# EAGLE design Physics_module_mount_v1.1 (EAGLE 7.2.0)
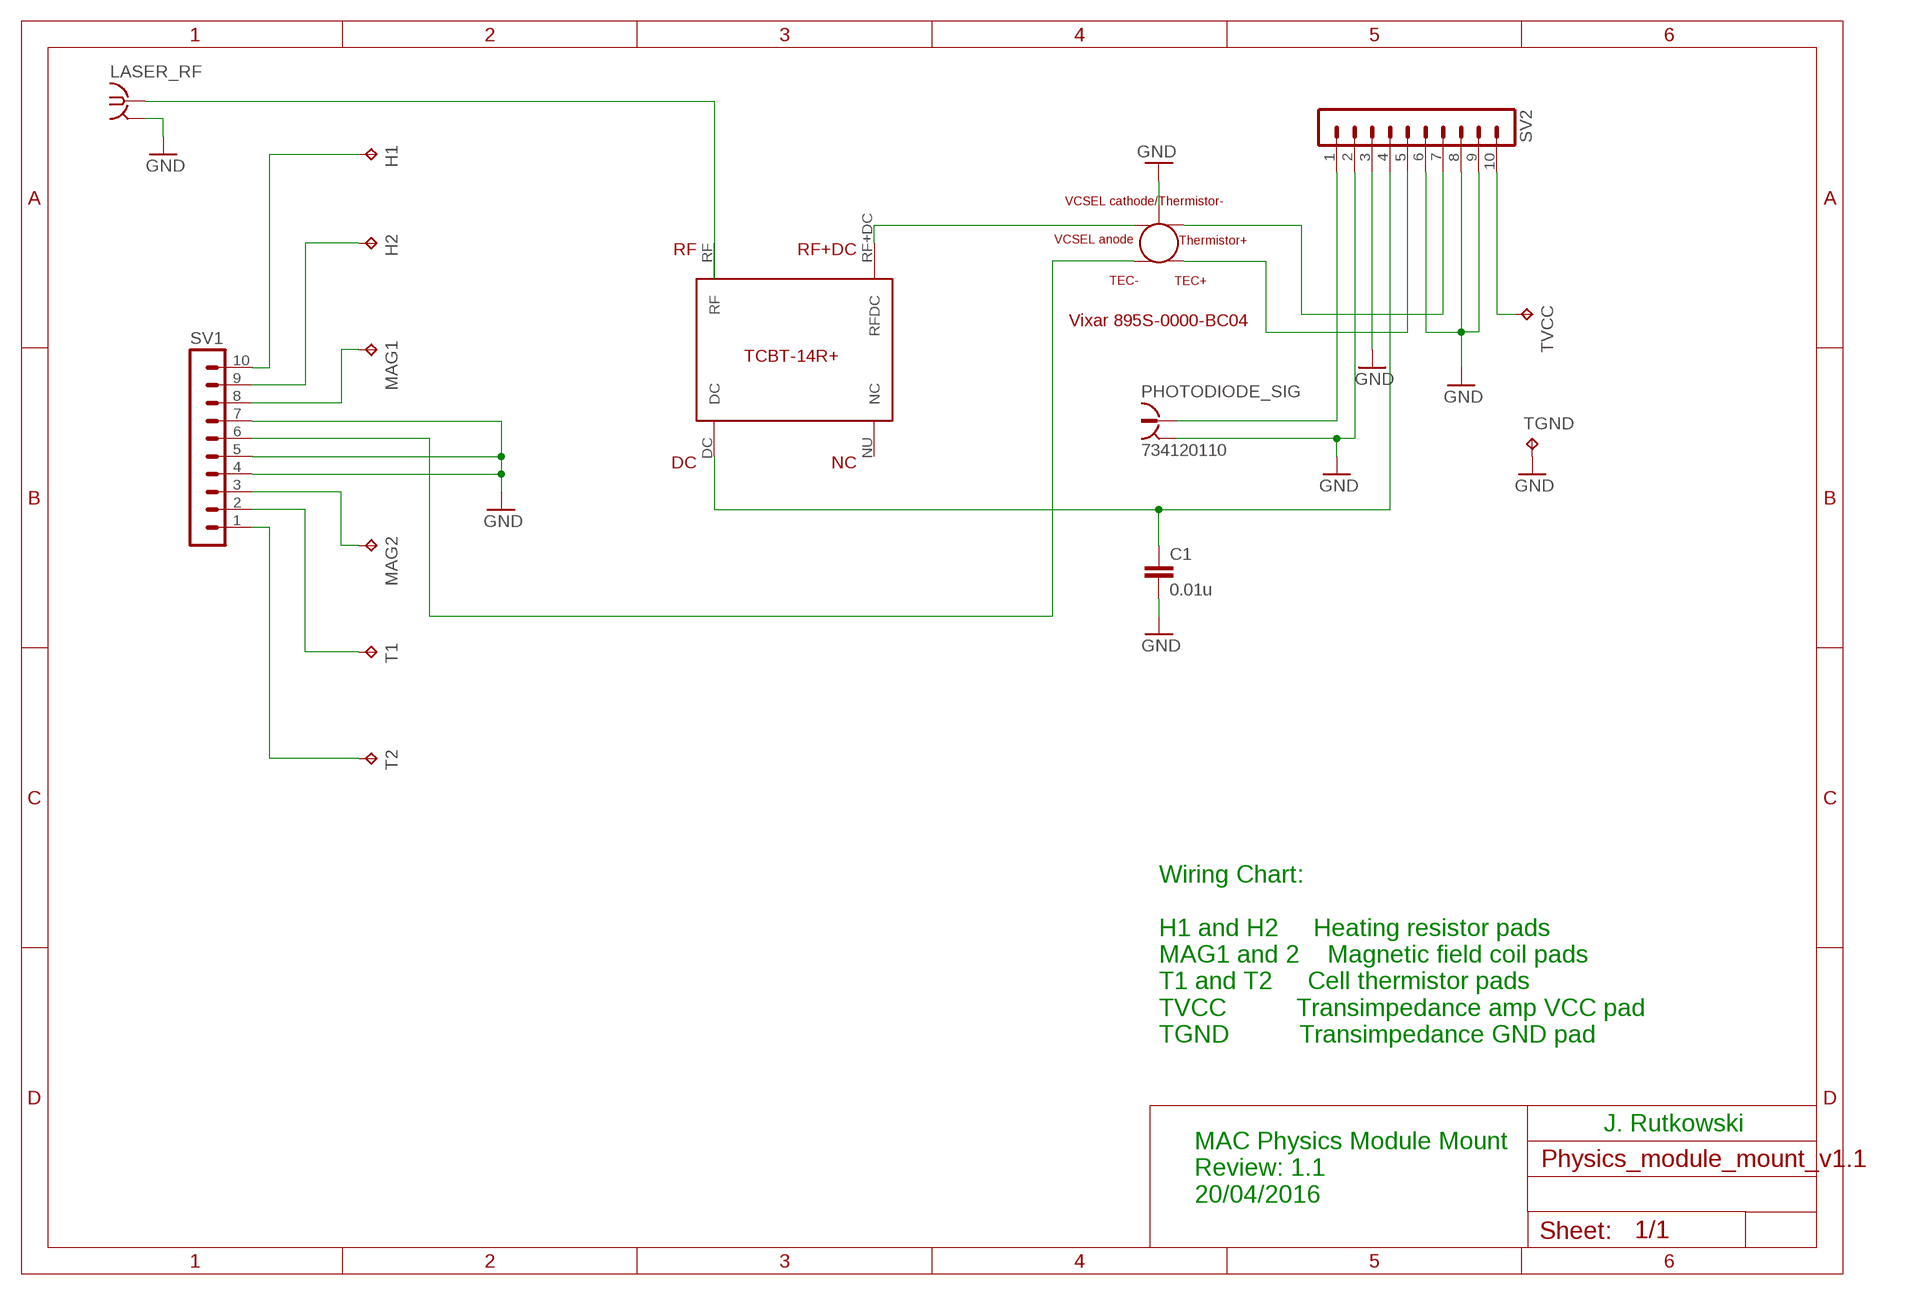
[diagram p0: schematic, sheet 1]

## Parts
C1  0.01u  C-EUC0603K  [C0603K]
H1  TPPAD1-13  [P1-13]
H2  TPPAD1-13  [P1-13]
LASER_RF  SMA-142-0711-871/876  [J502-ND-142-0711-871/876]
MAG1  TPPAD1-13  [P1-13]
MAG2  TPPAD1-13  [P1-13]
PHOTODIODE_SIG  734120110  [734120110]
Q1  VIXAR_895NM_VCSEL_TO46_6PIN  [TO45_THT_SMD]
SV1  MA10-1  [MA10-1]
SV2  MA10-1  [MA10-1]
T1  TPPAD1-13  [P1-13]
T2  TPPAD1-13  [P1-13]
TGND  TPPAD1-13  [P1-13]
TVCC  TPPAD1-13  [P1-13]
U1  TCBT-14+  [TCBT_14_PAC]

## Nets
GND: C1.2 LASER_RF.G@1 LASER_RF.G@2 LASER_RF.G@3 LASER_RF.G@4 PHOTODIODE_SIG.S@1 PHOTODIODE_SIG.S@2 PHOTODIODE_SIG.S@3 Q1.LD_CATHODE_THERM(VCSEL_CATHODE/THERMISTOR-/CASE) SV1.4 SV1.5 SV1.7 SV2.2 SV2.3 SV2.6 SV2.8 SV2.9 TGND.TP
N$1: H1.TP SV1.10
N$2: H2.TP SV1.9
N$3: MAG1.TP SV1.8
N$4: PHOTODIODE_SIG.1 SV2.1
N$5: SV1.2 T1.TP
N$6: SV1.1 T2.TP
N$7: SV2.10 TVCC.TP
N$9: LASER_RF.1 U1.RF
N$10: Q1.LD_ANODE(VCSEL_ANODE) U1.RF+DC(RFDC)
N$11: C1.1 SV2.4 U1.DC
N$12: Q1.THERMISTOR(THERMISTOR+) SV2.7
N$13: Q1.TEC+ SV2.5
N$14: Q1.TEC- SV1.6
N$15: MAG2.TP SV1.3
Unconnected: U1.NU(NC)

## Notes on the sheet
- Wiring Chart:
  
  H1 and H2     Heating resistor pads
  MAG1 and 2    Magnetic field coil pads
  T1 and T2     Cell thermistor pads
  TVCC          Transimpedance amp VCC pad
  TGND          Transimpedance GND pad
- J. Rutkowski
- MAC Physics Module Mount
  Review: 1.1
  20/04/2016

## Library data of the parts
C1 = rcl:C-EU: CAPACITOR, European symbol
H1 H2 MAG1 MAG2 T1 T2 TGND TVCC = testpad:TP: Test pad
LASER_RF = con-coax:SMA-: SMA 50 Ohm End Launch Jack Receptacle - Round Contact Johnson Components Source: www.johnsoncomponents.com .. J502-ND.pdf; MF: JOHNSON COMPONENTS; MPN: 142-0711-871; OC_FARNELL: unknown; OC_NEWARK: 01C1639
PHOTODIODE_SIG = con-coax:734120110: MICRO COAXIAL CONNECTOR RECEPTACLE VERTICAL Source: Data sheet <http://www.molex.com/pdm_docs/sd/734120110_sd.pdf>
Q1 = Laser_diodes:VIXAR_895NM_VCSEL_TO46_6PIN
SV1 SV2 = con-lstb:MA10-1: PIN HEADER; OC_FARNELL: unknown; OC_NEWARK: unknown
U1 = minicircuits_custom:TCBT-14+

## Board
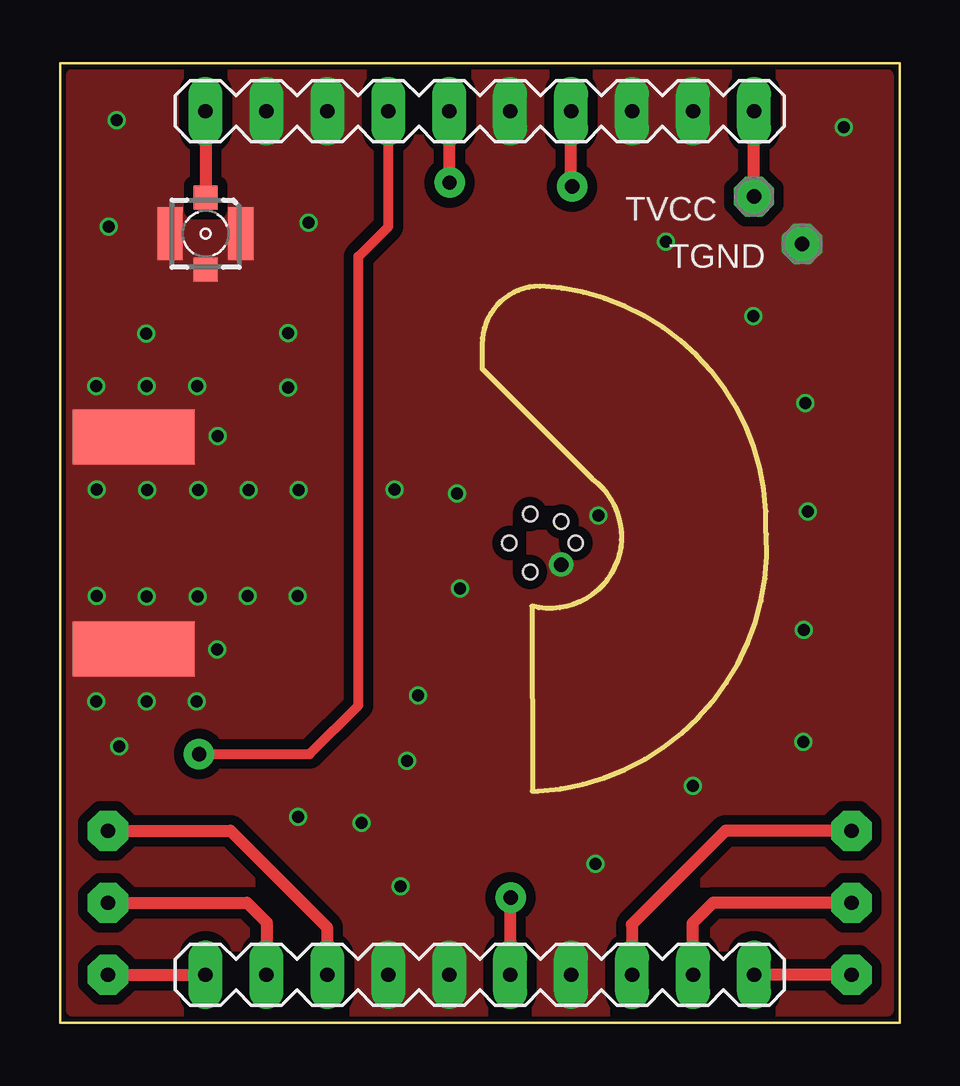
[diagram p1: board, top side]
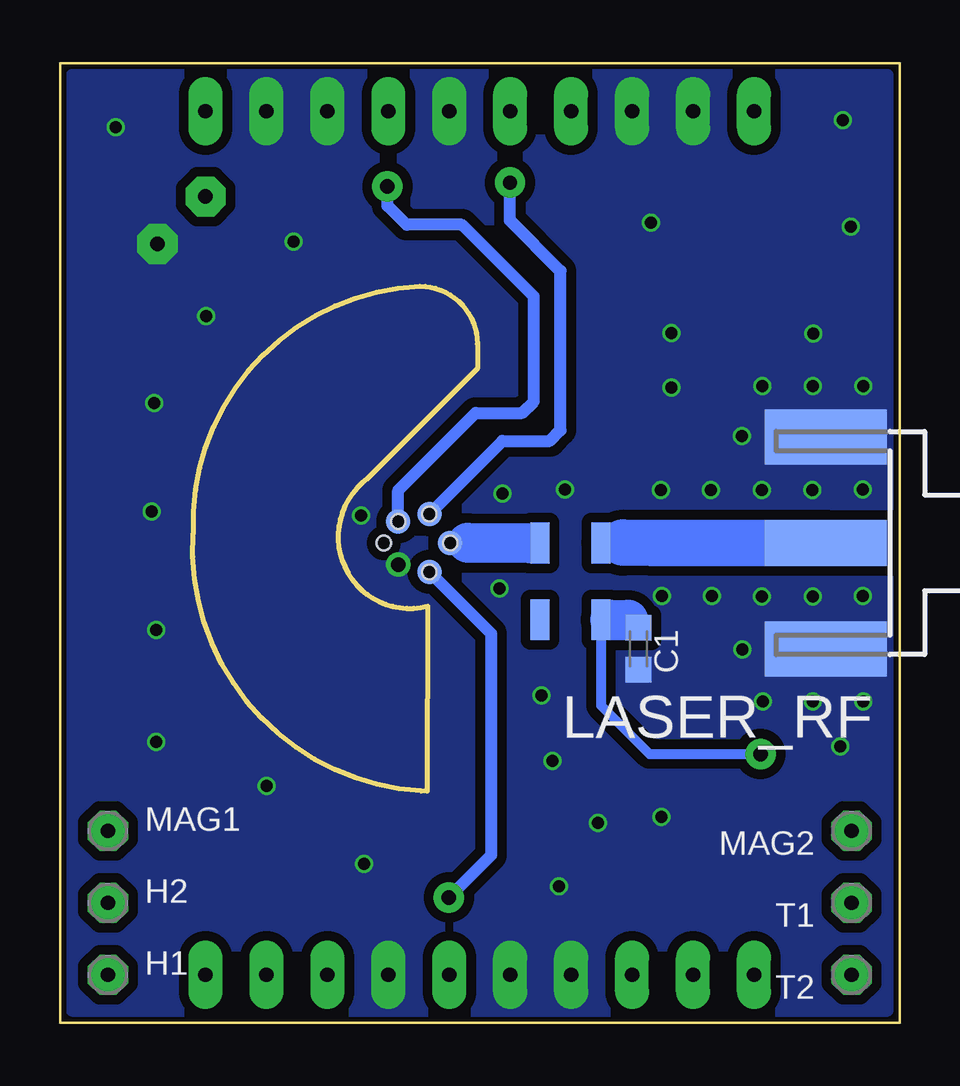
[diagram p2: board, bottom side, seen from below]

Size 35 x 40 mm. Coordinates in mm from the lower left corner, seen from the top.
Outline: 0,0 35,0 35,40 0,40 0,0
Copper layers (1*16): Top 0.018mm / dielectric 1.55mm / Bottom 0.018mm
Design rules "eC_2Layer_PClass6_BaseCopperO18_eCDefault *": minimum track width 0.15mm, minimum drill 0.35mm, track to track 0.15mm, track to pad 0.15mm, pad to pad 0.15mm, via to via 0.15mm, smd to smd 0mil, copper to edge 0mil, drill to drill 0mil, minimum pad ring 0.175mm, minimum via ring 0.125mm, stop-mask expansion 0mil, vias tented up to drill 0.45mm, thermal gap 0.2mm
Milling: area 17.6,9.7 to 29.5,30.7

### Footprints (pad centres in the part's own frame; a part is rotated, then mirrored left to right if it is on the bottom)
C0603K = smd 1.05 x 1.08: 1 -0.875,0; 2 0.875,0
P1-13 = drill 0.6 pad 1.676 octagon: TP 0,0
J502-ND-142-0711-871/876 = smd 5.08 x 1.905: 1 2.565,0 | smd 5.08 x 2.286: G@1 2.565,4.42; G@2 2.565,-4.42 | smd 5.08 x 2.286 bottom: G@3 2.565,4.42; G@4 2.565,-4.42
734120110 = smd 1 x 1: 1 0,-1.5; S@1 0,1.5 | smd 1.05 x 2.2: S@2 -1.475,0; S@3 1.475,0
TO45_THT_SMD = smd 1.016 x 1.016: LD_ANODE 0,1.27; TEC+ -1.205,0.4; TEC- 1.205,0.4; THERMISTOR -0.9,-0.9 | drill 0.6 pad 1.016: LD_CATHODE_THERM 0.9,-0.9 | hole 0.6: -1.205,0.4; 0,1.27; 1.205,0.4; -0.9,-0.9; 0,-1.5
MA10-1 = drill 0.6 pad 1.422 long: 1 -11.43,0; 2 -8.89,0; 3 -6.35,0; 4 -3.81,0; 5 -1.27,0; 6 1.27,0; 7 3.81,0; 8 6.35,0; 9 8.89,0; 10 11.43,0
TCBT_14_PAC = smd 0.8 x 1.7: DC -1.27,1.6; NU 1.27,1.6; RF -1.27,-1.6; RF+DC 1.27,-1.6

### Placement (x,y rotation side)
C1  10.89,15.59 270 bottom
H1  33,2 0 bottom
H2  33,5 0 bottom
LASER_RF  0.5,20 180 bottom
MAG1  33,8 0 bottom
MAG2  2,8 180 bottom
PHOTODIODE_SIG  6.07,32.89 180 top
Q1  20,20 270 bottom
SV1  17.5,2 0 top
SV2  17.5,38 0 top
T1  2,5 180 bottom
T2  2,2 180 bottom
TGND  30.94,32.47 180 top
TVCC  28.93,34.44 180 top
U1  13.72,18.4 180 bottom

### Tracks (layer width: path | path; a pad name or v marks a point on that pad's centre or on a via)
GND  (via drill 0.5)
  other vias: 2.36,37.62 2.04,33.19 3.59,28.73 9.52,28.74 10.36,33.36 9.52,26.48 1.52,13.39 6.55,15.56 2.46,11.52 14.93,13.64 13.94,22.23 14.47,10.91 9.93,8.58 12.58,8.34 14.19,5.69 22.32,6.63 26.39,9.87 30.98,11.71 31,16.38 31.18,21.31 31.08,25.83 28.91,29.46 25.26,32.56 32.68,37.34 22.45,21.14 1.52,26.54 3.61,26.54 5.71,26.54 6.57,24.46 1.53,22.22 3.64,22.21 5.75,22.21 7.86,22.21 9.95,22.21 9.9,17.78 7.82,17.78 5.73,17.77 3.62,17.77 1.53,17.78 16.55,22.06 16.67,18.1 5.7,13.39 3.61,13.39
  pour Bottom (isolate 0.406, no thermals): 0.5,39.5 34.5,39.5 34.5,0.5 0.5,0.5
  pour Top (isolate 0.406, no thermals): 0.5,39.5 34.5,39.5 34.5,0.5 0.5,0.5
N$1
  Top 0.5: H1.TP SV1.10
N$2
  Top 0.5: H2.TP 27.22,5 26.37,4.15 26.37,2.02 SV1.9
N$3
  Top 0.5: MAG1.TP 27.74,8 23.84,4.1 SV1.8
N$4
  Top 0.5: SV2.1 PHOTODIODE_SIG.1
N$5
  Top 0.5: T1.TP 7.8,5 8.62,4.18 SV1.2
N$6
  Top 0.5: T2.TP SV1.1
N$7
  Top 0.5: TVCC.TP SV2.10
N$9
  Bottom 0.813: 11.54,20.01 U1.RF
  Bottom 1.93: LASER_RF.1 10.33,20 11.54,20.01
N$10
  Bottom 0.406: 18,20 Q1.LD_ANODE
  Bottom 0.61: U1.RF+DC 15.42,19.98
  Bottom 1.676: 15.42,19.98 18,20
N$11  (via drill 0.6 pad 1.27)
  Top 0.406: v5.8,11.2 10.41,11.2 12.44,13.23 12.44,31.94 13.69,33.19 SV2.4
  Bottom 0.406: U1.DC 12.44,13.22 10.42,11.2 v5.8,11.2
  Bottom 0.61: U1.DC 12.06,16.8 12.06,16.79 | 11.31,16.79 10.89,16.79 C1.1
  Bottom 1.676: 12.06,16.79 11.31,16.79
N$12  (via drill 0.6 pad 1.27)
  Top 0.5: v21.35,34.86 21.31,34.9 SV2.7
  Bottom 0.5: v21.35,34.86 21.35,34.06 20.55,33.26 18.24,33.26 15.25,30.27 15.25,25.9 15.73,25.42 17.67,25.42 20.9,22.19 Q1.THERMISTOR
N$13  (via drill 0.6 pad 1.27)
  Top 0.5: 16.3,37.93 SV2.5 v16.23,35.03 v16.24,35.02
  Bottom 0.5: v16.24,35.02 16.24,33.45 14.13,31.34 14.13,24.7 14.58,24.25 16.55,24.25 Q1.TEC+
N$14  (via drill 0.6 pad 1.27)
  Top 0.5: v18.79,5.22 18.77,5.2 SV1.6
  Bottom 0.5: v18.79,5.22 17.03,6.98 17.03,16.23 Q1.TEC-
N$15
  Top 0.5: MAG2.TP 7.11,8 11.13,3.98 11.13,2.02 SV1.3

### Text on the board
Top_Legend: TVCC | TGND | Photodiode / Sig | Q1 | Laser RF | FEMTO-ST / MAC v1.1 | MAG2 | MAG1 | T1 | H2 | T2 | H1
Bottom_Legend: TVCC | TGND | C1 | U1 | FEMTO-ST / MAC v1.1 | MAG2 | MAG1 | T1 | H2 | T2 | H1